# EAGLE schematic shifter (EAGLE 5.11)
DRAWN_BY: Alexios; PROJECT_NAME: CFT Mini-Computer; REVISION: Rev B; SHEET_DESCRIPTION: Bus Connectors; SIMULATION_FILENAME: N/A; URL: http://www.bedroomlan.org/cft
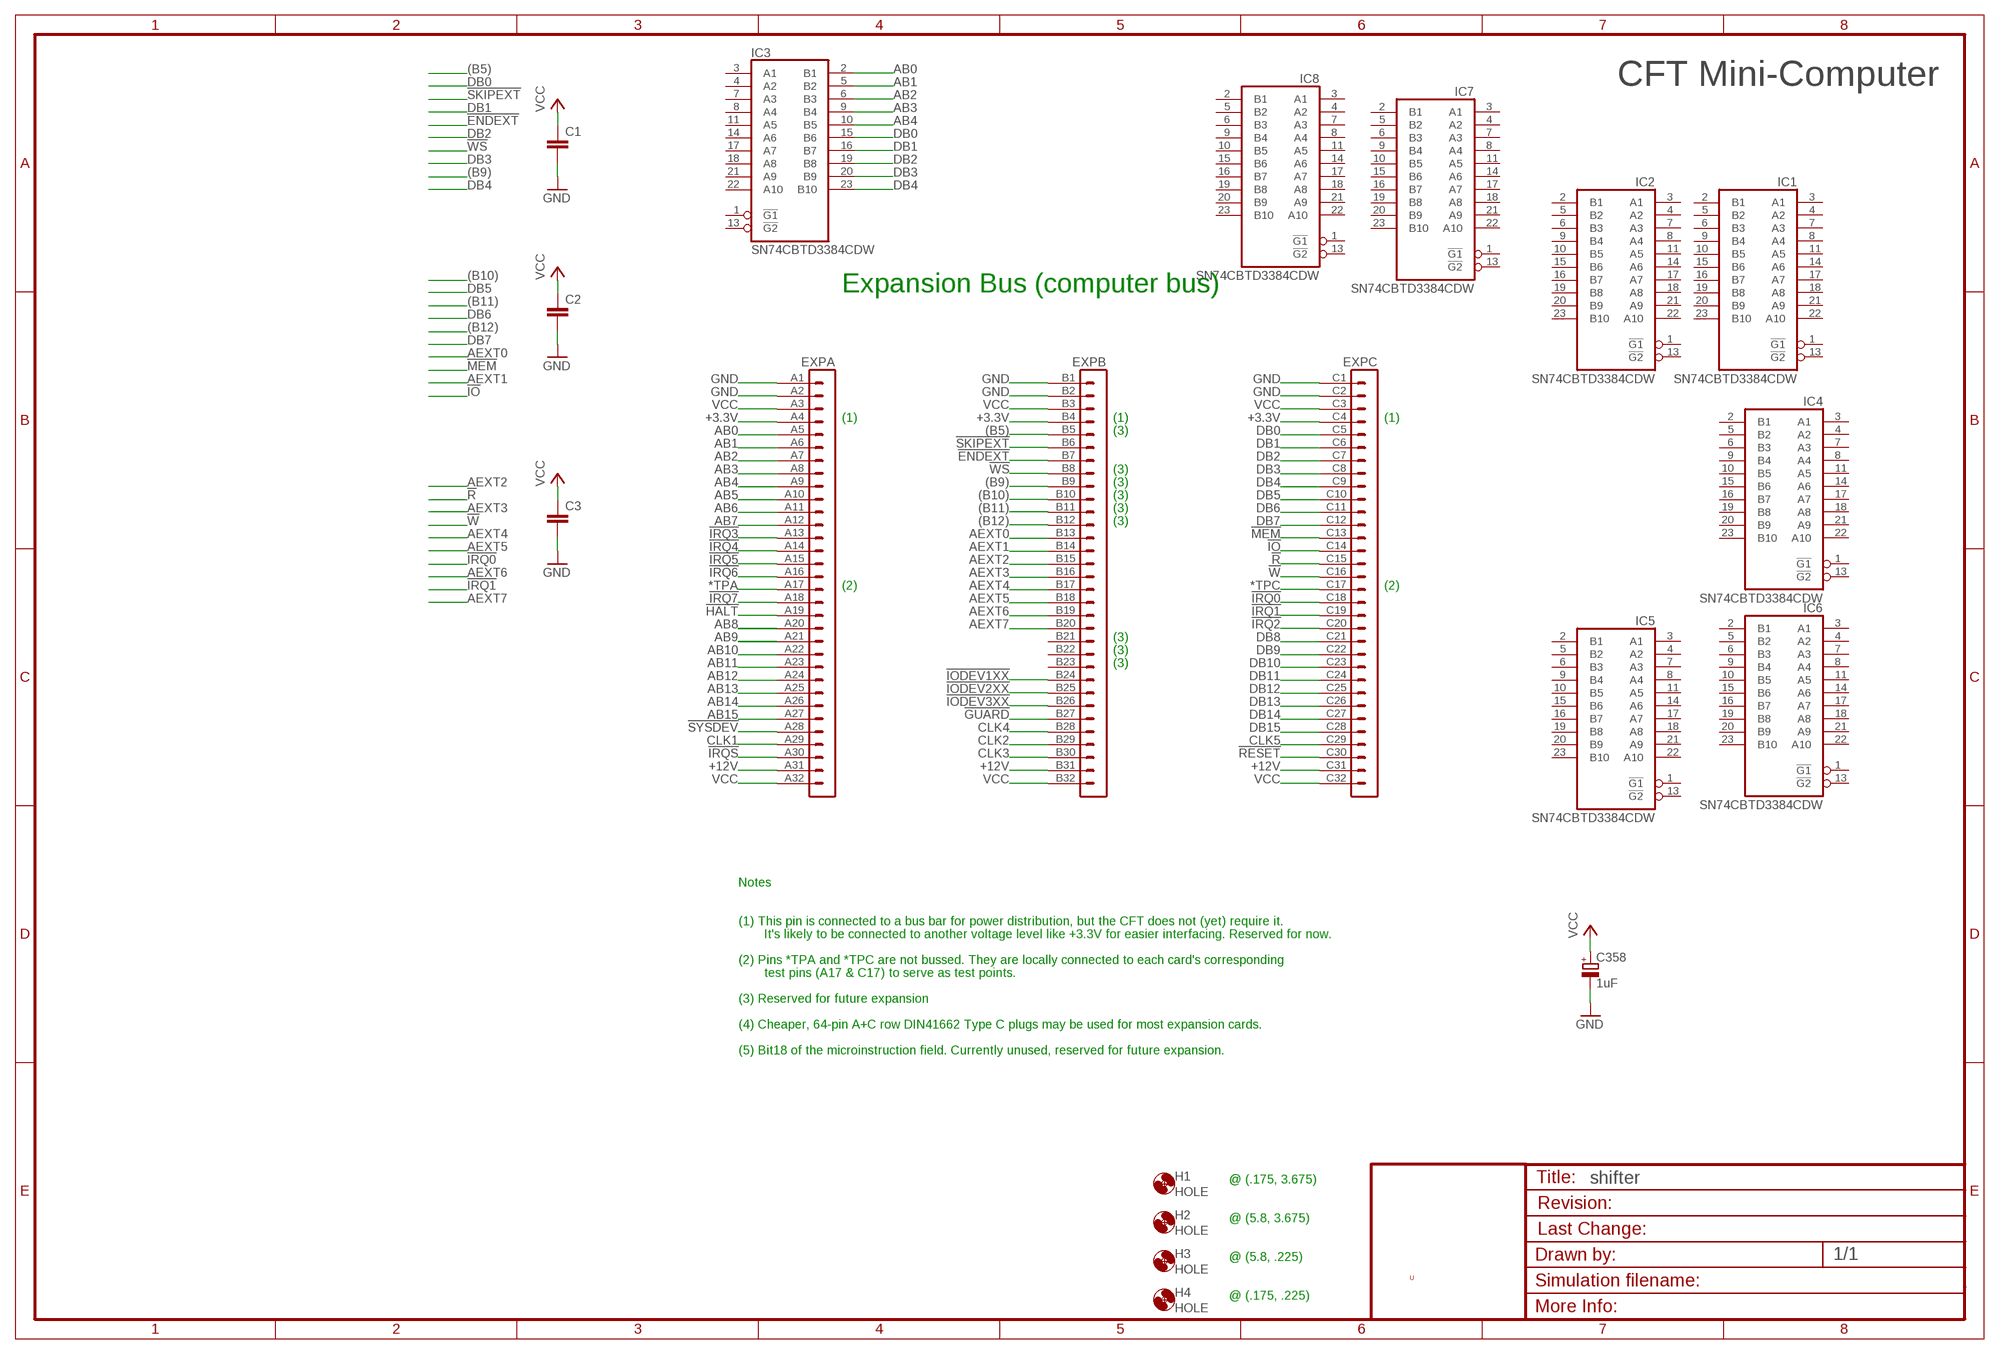
[diagram p0: schematic, sheet 1]

## Parts
C1  C-EUC1206  [C1206]
C2  C-EUC1206  [C1206]
C3  C-EUC1206  [C1206]
C358  1uF  CPOL-EUE2.5-5  [E2,5-5]
EXP  VG96-3K  [VG96K]
H1  HOLE  [STANDOFF_28_60]
H2  HOLE  [STANDOFF_28_60]
H3  HOLE  [STANDOFF_28_60]
H4  HOLE  [STANDOFF_28_60]
IC1  SN74CBTD3384CDW  [SO24W]
IC2  SN74CBTD3384CDW  [SO24W]
IC3  SN74CBTD3384CDW  [SO24W]
IC4  SN74CBTD3384CDW  [SO24W]
IC5  SN74CBTD3384CDW  [SO24W]
IC6  SN74CBTD3384CDW  [SO24W]
IC7  SN74CBTD3384CDW  [SO24W]
IC8  SN74CBTD3384CDW  [SO24W]

## Nets
!ENDEXT: EXP.B7
!GUARD: EXP.B27
!HALT: EXP.A19
!IO: EXP.C14
!IODEV1XX: EXP.B24
!IODEV2XX: EXP.B25
!IODEV3XX: EXP.B26
!IRQ0: EXP.C18
!IRQ1: EXP.C19
!IRQ2: EXP.C20
!IRQ3: EXP.A13
!IRQ4: EXP.A14
!IRQ5: EXP.A15
!IRQ6: EXP.A16
!IRQ7: EXP.A18
!IRQS: EXP.A30
!MEM: EXP.C13
!R: EXP.C15
!RESET: EXP.C30
!SKIPEXT: EXP.B6
!SYSDEV: EXP.A28
!W: EXP.C16
!WS: EXP.B8
(B5): EXP.B5
(B9): EXP.B9
(B10): EXP.B10
(B11): EXP.B11
(B12): EXP.B12
*TPA: EXP.A17
*TPC: EXP.C17
+3.3V: EXP.A4 EXP.B4 EXP.C4
+12V [LED power]: EXP.A31 EXP.B31 EXP.C31
AB0: EXP.A5 IC3.2(B1)
AB1: EXP.A6 IC3.5(B2)
AB2: EXP.A7 IC3.6(B3)
AB3: EXP.A8 IC3.9(B4)
AB4: EXP.A9 IC3.10(B5)
AB5: EXP.A10
AB6: EXP.A11
AB7: EXP.A12
AB8: EXP.A20
AB9: EXP.A21
AB10: EXP.A22
AB11: EXP.A23
AB12: EXP.A24
AB13: EXP.A25
AB14: EXP.A26
AB15: EXP.A27
AEXT0: EXP.B13
AEXT1: EXP.B14
AEXT2: EXP.B15
AEXT3: EXP.B16
AEXT4: EXP.B17
AEXT5: EXP.B18
AEXT6: EXP.B19
AEXT7: EXP.B20
CLK1: EXP.A29
CLK2: EXP.B29
CLK3: EXP.B30
CLK4: EXP.B28
CLK5: EXP.C29
DB0: EXP.C5 IC3.15(B6)
DB1: EXP.C6 IC3.16(B7)
DB2: EXP.C7 IC3.19(B8)
DB3: EXP.C8 IC3.20(B9)
DB4: EXP.C9 IC3.23(B10)
DB5: EXP.C10
DB6: EXP.C11
DB7: EXP.C12
DB8: EXP.C21
DB9: EXP.C22
DB10: EXP.C23
DB11: EXP.C24
DB12: EXP.C25
DB13: EXP.C26
DB14: EXP.C27
DB15: EXP.C28
GND [low power]: C1.2 C2.2 C3.2 C358.- EXP.A1 EXP.A2 EXP.B1 EXP.B2 EXP.C1 EXP.C2
VCC [low power]: C1.1 C2.1 C3.1 C358.+ EXP.A3 EXP.A32 EXP.B3 EXP.B32 EXP.C3 EXP.C32
Unconnected: EXP.B21 EXP.B22 EXP.B23 IC1.1(!G1) IC1.2(B1) IC1.3(A1) IC1.4(A2) IC1.5(B2) IC1.6(B3) IC1.7(A3) IC1.8(A4) IC1.9(B4) IC1.10(B5) IC1.11(A5) IC1.13(!G2) IC1.14(A6) IC1.15(B6) IC1.16(B7) IC1.17(A7) IC1.18(A8) IC1.19(B8) IC1.20(B9) IC1.21(A9) IC1.22(A10) IC1.23(B10) IC2.1(!G1) IC2.2(B1) IC2.3(A1) IC2.4(A2) IC2.5(B2) IC2.6(B3) IC2.7(A3) IC2.8(A4) IC2.9(B4) IC2.10(B5) IC2.11(A5) IC2.13(!G2) IC2.14(A6) IC2.15(B6) IC2.16(B7) IC2.17(A7) IC2.18(A8) IC2.19(B8) IC2.20(B9) IC2.21(A9) IC2.22(A10) IC2.23(B10) IC3.1(!G1) IC3.3(A1) IC3.4(A2) IC3.7(A3) IC3.8(A4) IC3.11(A5) IC3.13(!G2) IC3.14(A6) IC3.17(A7) IC3.18(A8) IC3.21(A9) IC3.22(A10) IC4.1(!G1) IC4.2(B1) IC4.3(A1) IC4.4(A2) IC4.5(B2) IC4.6(B3) IC4.7(A3) IC4.8(A4) IC4.9(B4) IC4.10(B5) IC4.11(A5) IC4.13(!G2) IC4.14(A6) IC4.15(B6) IC4.16(B7) IC4.17(A7) IC4.18(A8) IC4.19(B8) IC4.20(B9) IC4.21(A9) IC4.22(A10) IC4.23(B10) IC5.1(!G1) IC5.2(B1) IC5.3(A1) IC5.4(A2) IC5.5(B2) IC5.6(B3) IC5.7(A3) IC5.8(A4) IC5.9(B4) IC5.10(B5) IC5.11(A5) IC5.13(!G2) IC5.14(A6) IC5.15(B6) IC5.16(B7) IC5.17(A7) IC5.18(A8) IC5.19(B8) IC5.20(B9) IC5.21(A9) IC5.22(A10) IC5.23(B10) IC6.1(!G1) IC6.2(B1) IC6.3(A1) IC6.4(A2) IC6.5(B2) IC6.6(B3) IC6.7(A3) IC6.8(A4) IC6.9(B4) IC6.10(B5) IC6.11(A5) IC6.13(!G2) IC6.14(A6) IC6.15(B6) IC6.16(B7) IC6.17(A7) IC6.18(A8) IC6.19(B8) IC6.20(B9) IC6.21(A9) IC6.22(A10) IC6.23(B10) IC7.1(!G1) IC7.2(B1) IC7.3(A1) IC7.4(A2) IC7.5(B2) IC7.6(B3) IC7.7(A3) IC7.8(A4) IC7.9(B4) IC7.10(B5) IC7.11(A5) IC7.13(!G2) IC7.14(A6) IC7.15(B6) IC7.16(B7) IC7.17(A7) IC7.18(A8) IC7.19(B8) IC7.20(B9) IC7.21(A9) IC7.22(A10) IC7.23(B10) IC8.1(!G1) IC8.2(B1) IC8.3(A1) IC8.4(A2) IC8.5(B2) IC8.6(B3) IC8.7(A3) IC8.8(A4) IC8.9(B4) IC8.10(B5) IC8.11(A5) IC8.13(!G2) IC8.14(A6) IC8.15(B6) IC8.16(B7) IC8.17(A7) IC8.18(A8) IC8.19(B8) IC8.20(B9) IC8.21(A9) IC8.22(A10) IC8.23(B10)

## Notes on the sheet
- CFT Mini-Computer
- Expansion Bus (computer bus)
- (1) | (1) | (1)
- (3)
- (3)
- (3)
- (3)
- (3)
- (3)
- (2) | (2)
- (3)
- (3)
- (3)
- Notes
- (1) This pin is connected to a bus bar for power distribution, but the CFT does not (yet) require it.
- It's likely to be connected to another voltage level like +3.3V for easier interfacing. Reserved for now.
- (2) Pins *TPA and *TPC are not bussed. They are locally connected to each card's corresponding
- test pins (A17 & C17) to serve as test points.
- (3) Reserved for future expansion
- (4) Cheaper, 64-pin A+C row DIN41662 Type C plugs may be used for most expansion cards.
- (5) Bit18 of the microinstruction field. Currently unused, reserved for future expansion.
- @ (.175, 3.675)
- @ (5.8, 3.675)
- @ (5.8, .225)
- U
- @ (.175, .225)

## Power pins joined to a net without a drawn wire
GND: IC1.12(GND) IC2.12(GND) IC3.12(GND) IC4.12(GND) IC5.12(GND) IC6.12(GND) IC7.12(GND) IC8.12(GND)
VCC: IC1.24(VCC) IC2.24(VCC) IC3.24(VCC) IC4.24(VCC) IC5.24(VCC) IC6.24(VCC) IC7.24(VCC) IC8.24(VCC)

## Library data of the parts
C1-C3 = rcl:C-EU: CAPACITOR, European symbol
C358 = rcl:CPOL-EU: POLARIZED CAPACITOR, European symbol
EXP = alexios-19inch:VG96-3: PCB EUROCARD, 96-pin type C/ABC, 2.54 mm
H1-H4 = alexios:HOLE: Hole for a standoff or mount. Hole diameter: 3.3mm. External Diameter: 6mm.
IC1-IC8 = alexios:SN74CBTD3384C: 10-bit FET Bus Switch with Level Shifting. 5V bus switch with -2V undershoot protection. Two 5-bit groups with separate enables. Datasheet: http://www.ti.com/lit/ds/symlink/sn74cbtd3384c.pdf Farnell: 1753582 <http://uk.farnell.com/texas-instruments/sn74cbtd3384cdw/logic-switch-bus-fet-10bit-24soic/dp/1753582>

## Net classes
0 default: width 0.305 mm, clearance 0.203 mm
1 low power: width 1.27 mm, clearance 0.254 mm
2 LED power: width 1.93 mm, clearance 0.254 mm